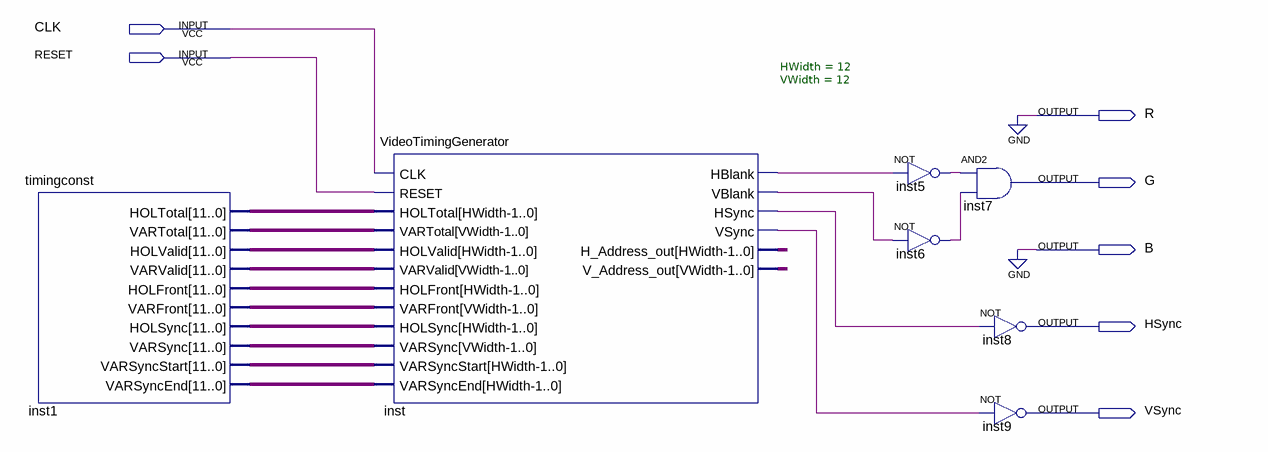
[diagram p0: schematic sheet]
// Quartus schematic ChiinaDazzler.bdf as structural Verilog: 7 symbols, 7 pins
module ChiinaDazzler (
  input  CLK,
  input  RESET,
  output R,
  output G,
  output B,
  output HSync,
  output VSync
);

  wire inst5_out, inst6_out, inst_hblank, inst_hsync, inst_vblank, inst_vsync;
  wire [11:0] inst1_holfront, inst1_holsync, inst1_holtotal, inst1_holvalid, inst1_varfront, inst1_varsync,
       inst1_varsyncend, inst1_varsyncstart, inst1_vartotal, inst1_varvalid, inst_h_address_out,
       inst_v_address_out;

  timingconst inst1 (
    .HOLTotal(inst1_holtotal), .VARTotal(inst1_vartotal), .HOLValid(inst1_holvalid),
    .VARValid(inst1_varvalid), .HOLFront(inst1_holfront), .VARFront(inst1_varfront), .HOLSync(inst1_holsync),
    .VARSync(inst1_varsync), .VARSyncStart(inst1_varsyncstart), .VARSyncEnd(inst1_varsyncend));
  VideoTimingGenerator #(.HWidth(12), .VWidth(12)) inst (
    .CLK(CLK), .RESET(RESET), .HOLTotal(inst1_holtotal), .VARTotal(inst1_vartotal),
    .HOLValid(inst1_holvalid), .VARValid(inst1_varvalid), .HOLFront(inst1_holfront),
    .VARFront(inst1_varfront), .HOLSync(inst1_holsync), .VARSync(inst1_varsync),
    .VARSyncStart(inst1_varsyncstart), .VARSyncEnd(inst1_varsyncend), .HBlank(inst_hblank),
    .VBlank(inst_vblank), .HSync(inst_hsync), .VSync(inst_vsync), .H_Address_out(inst_h_address_out),
    .V_Address_out(inst_v_address_out));
  not inst5 (inst5_out, inst_hblank);
  not inst6 (inst6_out, inst_vblank);
  and inst7 (G, inst5_out, inst6_out);
  not inst8 (HSync, inst_hsync);
  not inst9 (VSync, inst_vsync);

  assign B = 1'b0;
  assign R = 1'b0;
endmodule
